# EAGLE design main2 (EAGLE 7.2.0)
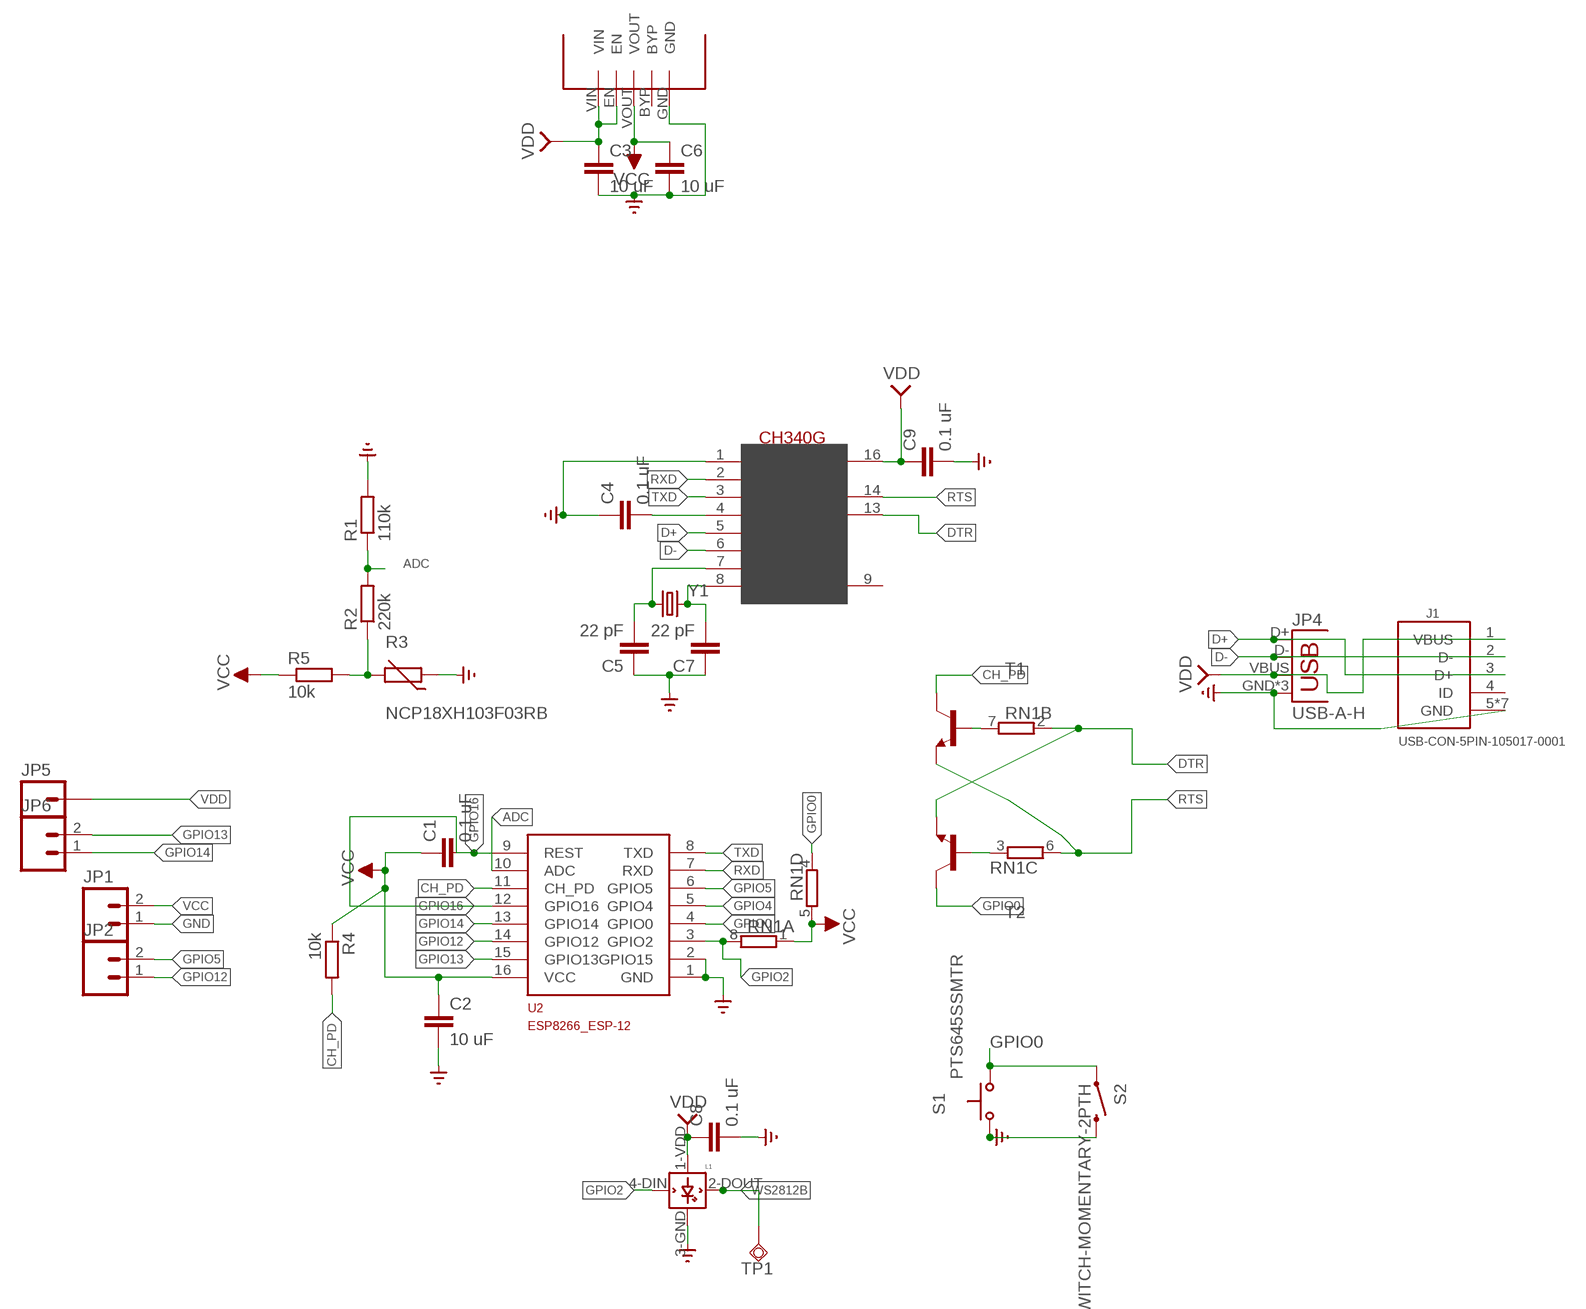
[diagram p0: schematic, sheet 1]

## Parts
C1  0.1 uF  C-EUC0603K  [C0603K]
C2  10 uF  C-EUC0603K  [C0603K]
C3  10 uF  C-EUC0603K  [C0603K]
C4  0.1 uF  C-EUC0603K  [C0603K]
C5  22 pF  C-EUC0805K  [C0805K]
C6  10 uF  C-EUC0603K  [C0603K]
C7  22 pF  C-EUC0805K  [C0805K]
C8  0.1 uF  C-EUC0603K  [C0603K]
C9  0.1 uF  C-EUC0603K  [C0603K]
J1  USB-CON-5PIN-105017-0001  [USB-MICRO-MOLEX-105017-0001]
JP1  M02LOCK  [1X02_LOCK]
JP2  M02LOCK  [1X02_LOCK]
JP4  USB-A-H  [USB-A-H]
JP5  M01PTH  [1X01]
JP6  M02LOCK  [1X02_LOCK]
L1  WS2812B  [WS2812B]
R1  110k  R-EU_R0603  [R0603]
R2  220k  R-EU_R0603  [R0603]
R3  NCP18XH103F03RB  [0603-RES]
R4  10k  R-EU_R0805  [R0805]
R5  10k  R-EU_R0805  [R0805]
RN1  4R-NEXB38V  [EXB38V]
S1  PTS645SSMTR  [PTS645-SMD]
S2  SWITCH-MOMENTARY-2PTH  [TACTILE-PTH]
T1  MMBT2222ALT1-NPN-SOT23-BEC  [SOT23-BEC]
T2  MMBT2222ALT1-NPN-SOT23-BEC  [SOT23-BEC]
TP1  TPSQTP20SQ  [TP20SQ]
U1  SPX3819  [SOT23-5L]
U2  ESP8266_ESP-12  [ESP8266-ESP12]
U3  CH340G  [SOIC16]
Y1  CRYSTALSM49  [SM49]

## Nets
ADC: R1.1 R2.2 U2.10(ADC)
CH_PD: R4.2 T1.C U2.11(CH_PD)
D+: J1.3(D+) JP4.D+ U3.5(D+)
D-: J1.2(D-) JP4.D- U3.6(D-)
DTR: RN1.2 T2.E U3.13(DTR)
GND: C2.2 C3.2 C4.1 C5.1 C6.2 C7.1 C8.2 C9.2 J1.5(GND) J1.P$1(GND) J1.P$2(GND) J1.P$3(GND) J1.P$4(GND) J1.P$5(GND) J1.P$6(GND) JP1.1 JP4.GND JP4.GND2(GND) JP4.GND3(GND) L1.3-GND(GND) R1.2 R3.1 S1.1(P) S1.2(P) S2.3 S2.4 U1.GND U2.1(GND) U2.2(GPIO15) U3.1(GND) ; supply symbol labelled GND_
GPIO0: RN1.4 S1.3(S) S1.4(S) S2.1 S2.2 T2.C U2.4(GPIO0)
GPIO2: L1.4-DIN(DIN) RN1.8 U2.3(GPIO2)
GPIO4: U2.5(GPIO4)
GPIO5: JP2.2 U2.6(GPIO5)
GPIO12: JP2.1 U2.14(GPIO12)
GPIO13: JP6.2 U2.15(GPIO13)
GPIO14: JP6.1 U2.13(GPIO14)
GPIO16: C1.2 U2.9(REST) U2.12(GPIO16)
N$1: C4.2 U3.4(V3)
N$2: RN1.3 T2.B
N$3: RN1.7 T1.B
N$4: C5.2 U3.7(XI) Y1.1
N$5: C7.2 U3.8(XO) Y1.2
N$7: R2.1 R3.2 R5.2
RTS: RN1.6 T1.E U3.14(RTS)
RXD: U2.7(RXD) U3.2(TX)
TXD: U2.8(TXD) U3.3(RX)
VCC: C1.1 C2.1 C6.1 JP1.2 R4.1 R5.1 RN1.1 RN1.5 U1.VOUT U2.16(VCC)
VDD: C3.1 C8.1 C9.1 J1.1(VBUS) JP4.VBUS JP5.1 L1.1-VDD(VDD) U1.EN U1.VIN U3.16(VCC)
WS2812B: L1.2-DOUT(DOUT) TP1.TP
Unconnected: J1.4(ID) U1.BYP U3.9(CTS)

## Library data of the parts
C1-C9 = resistor:C-EU: CAPACITOR, European symbol
J1 = VladiLib:USB-CON-5PIN: Molex Micro USB 105017-0001
JP1 JP2 JP6 = SparkFun-Connectors:M02: Standard 2-pin 0.1" header. Use with - straight break away headers ( PRT-00116) - right angle break away headers (PRT-00553) - swiss pins (PRT-00743) - machine pins (PRT-00117) - female headers (PRT-00115) Molex polarized connector foot print use with: PRT-08233 with associated crimp pins and housings. 2.54_SCREWTERM for use with PRT-10571. 3.5mm Screw Terminal footprints for PRT-08084 5mm Screw Terminal footprints for use with PRT-08432
JP4 = VladiLib:USB: USB Connectors USB-B-PTH is fully proven SKU : PRT-00139/CONN-08278 USB-miniB is fully proven SKU : PRT-00587 USB-A-PCB is untested. USB-A-H is throughly reviewed, but untested. Spark Fun Electronics SKU : PRT-00437 USB-B-SMT is throughly reviewed, but untested. Needs silkscreen touching up. USB-A-S has not been used/tested USB-MB-H has not been used/tested USB-MICROB has been used. CONN-09505; PROD_ID: CONN-08367
JP5 = SparkFun-Connectors:M01: Header 1 Standard 1-pin 0.1" header. Use with straight break away headers (SKU : PRT-00116), right angle break away headers (PRT-00553), swiss pins (PRT-00743), machine pins (PRT-00117), and female headers (PRT-00115).
L1 = VladiLib:WS2812B
R1 R2 R4 R5 = resistor:R-EU_: RESISTOR, European symbol
R3 = VladiLib:NCP18XH103F03RB: NTC 10K 1% B25/100 3455K
RN1 = resistor-dil:4R-N: Array Chip Resistor Source: RS Component / Phycomp; OC_FARNELL: unknown; OC_NEWARK: unknown
S1 = switch-ck:PTS645S???SMTR: TACT SWITCH
S2 = VladiLib:SWITCH-MOMENTARY-2: Various NO switches- pushbuttons, reed, etc; PROD_ID: SWCH-08441
T1 T2 = transistor:*-NPN-: NPN Transistror BF959 corrected 2008.03.06
TP1 = testpad:TPSQ: Test pad
U1 = VladiLib:SPX3819
U2 = VladiLib:ESP8266_ESP-12
U3 = VladiLib:CH340G
Y1 = crystal:CRYSTAL: CRYSTAL; OC_FARNELL: unknown; OC_NEWARK: unknown

## Board
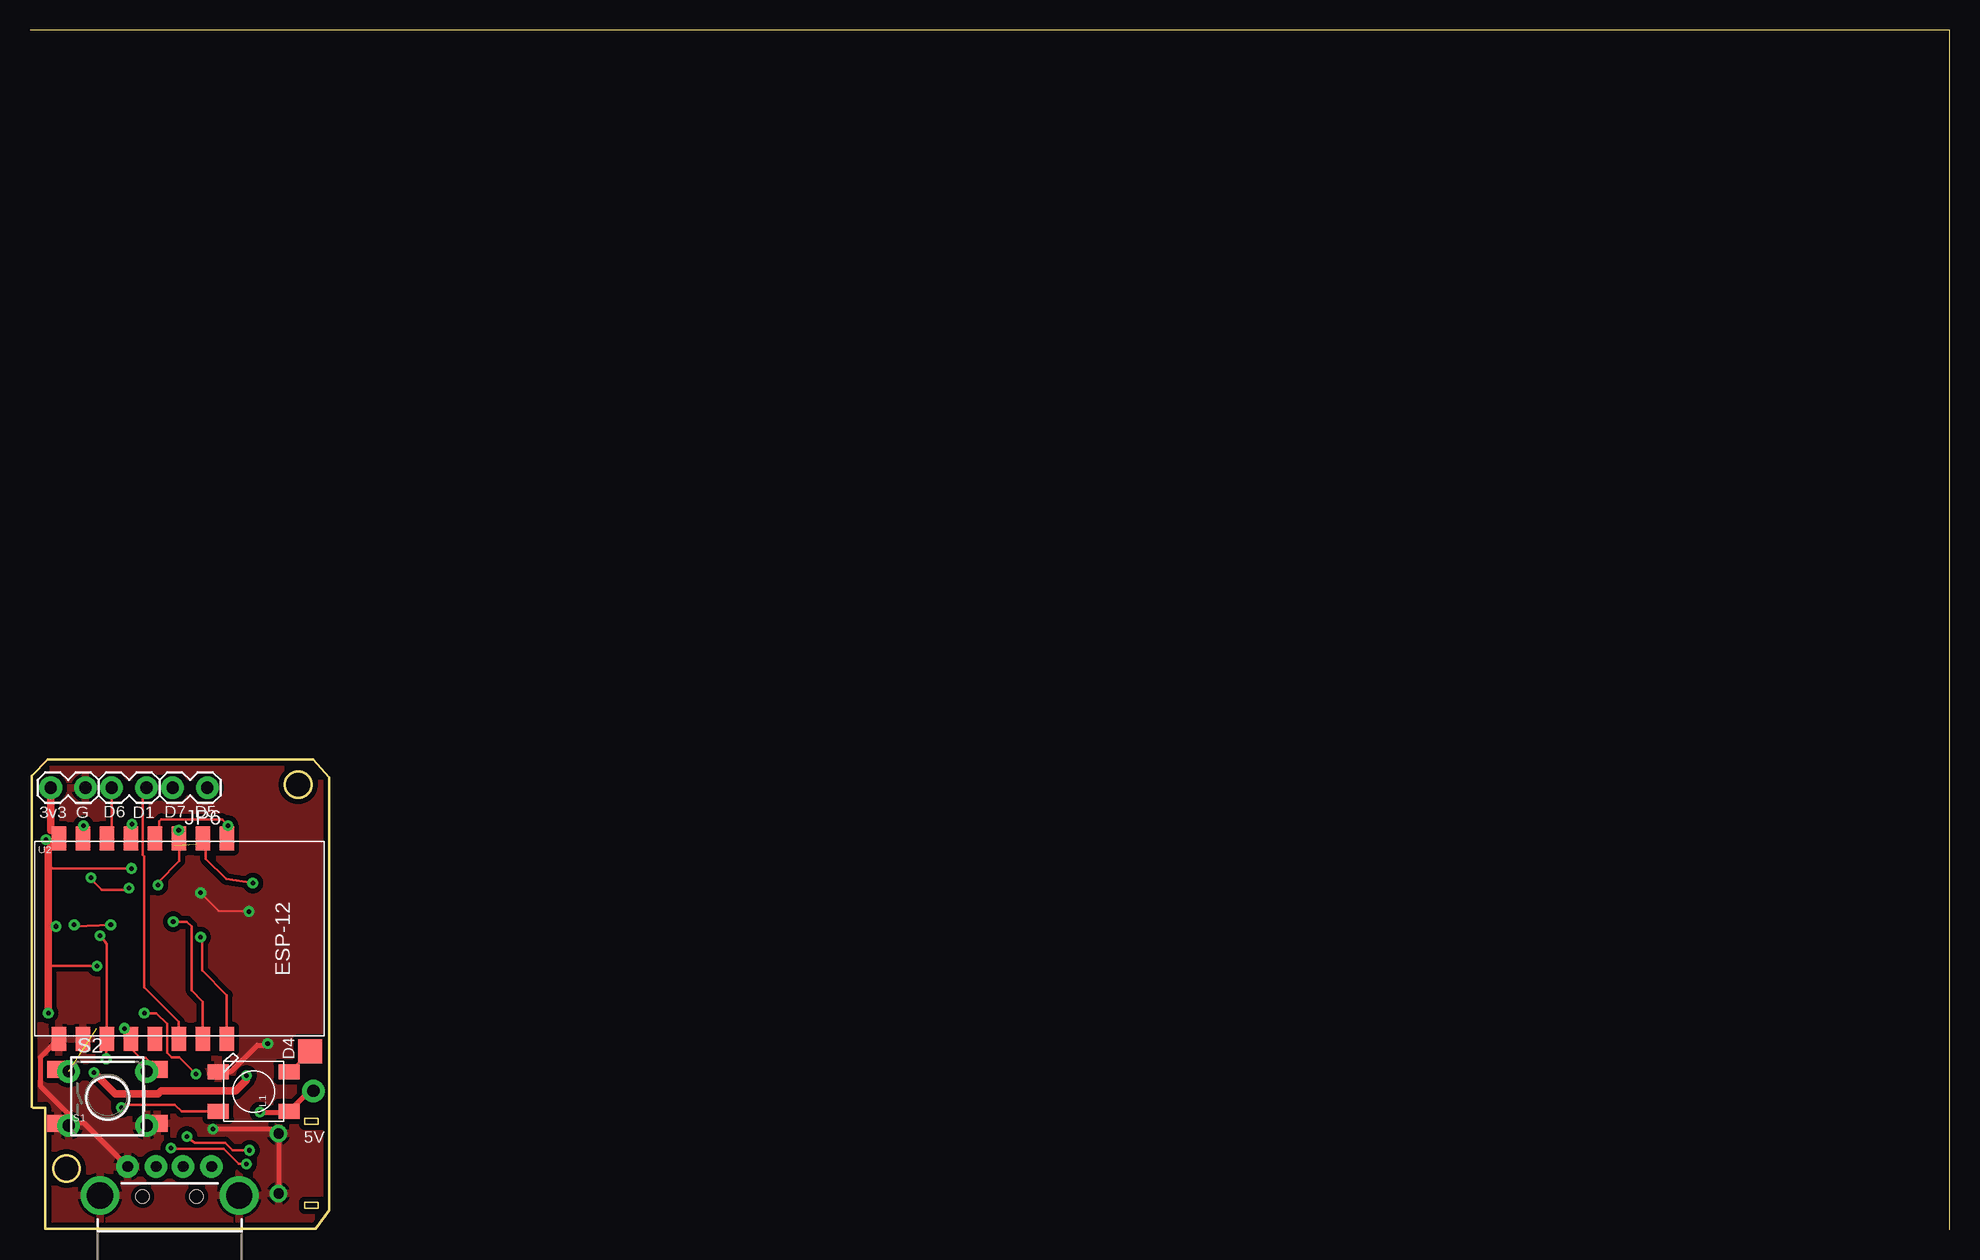
[diagram p1: board, top side]
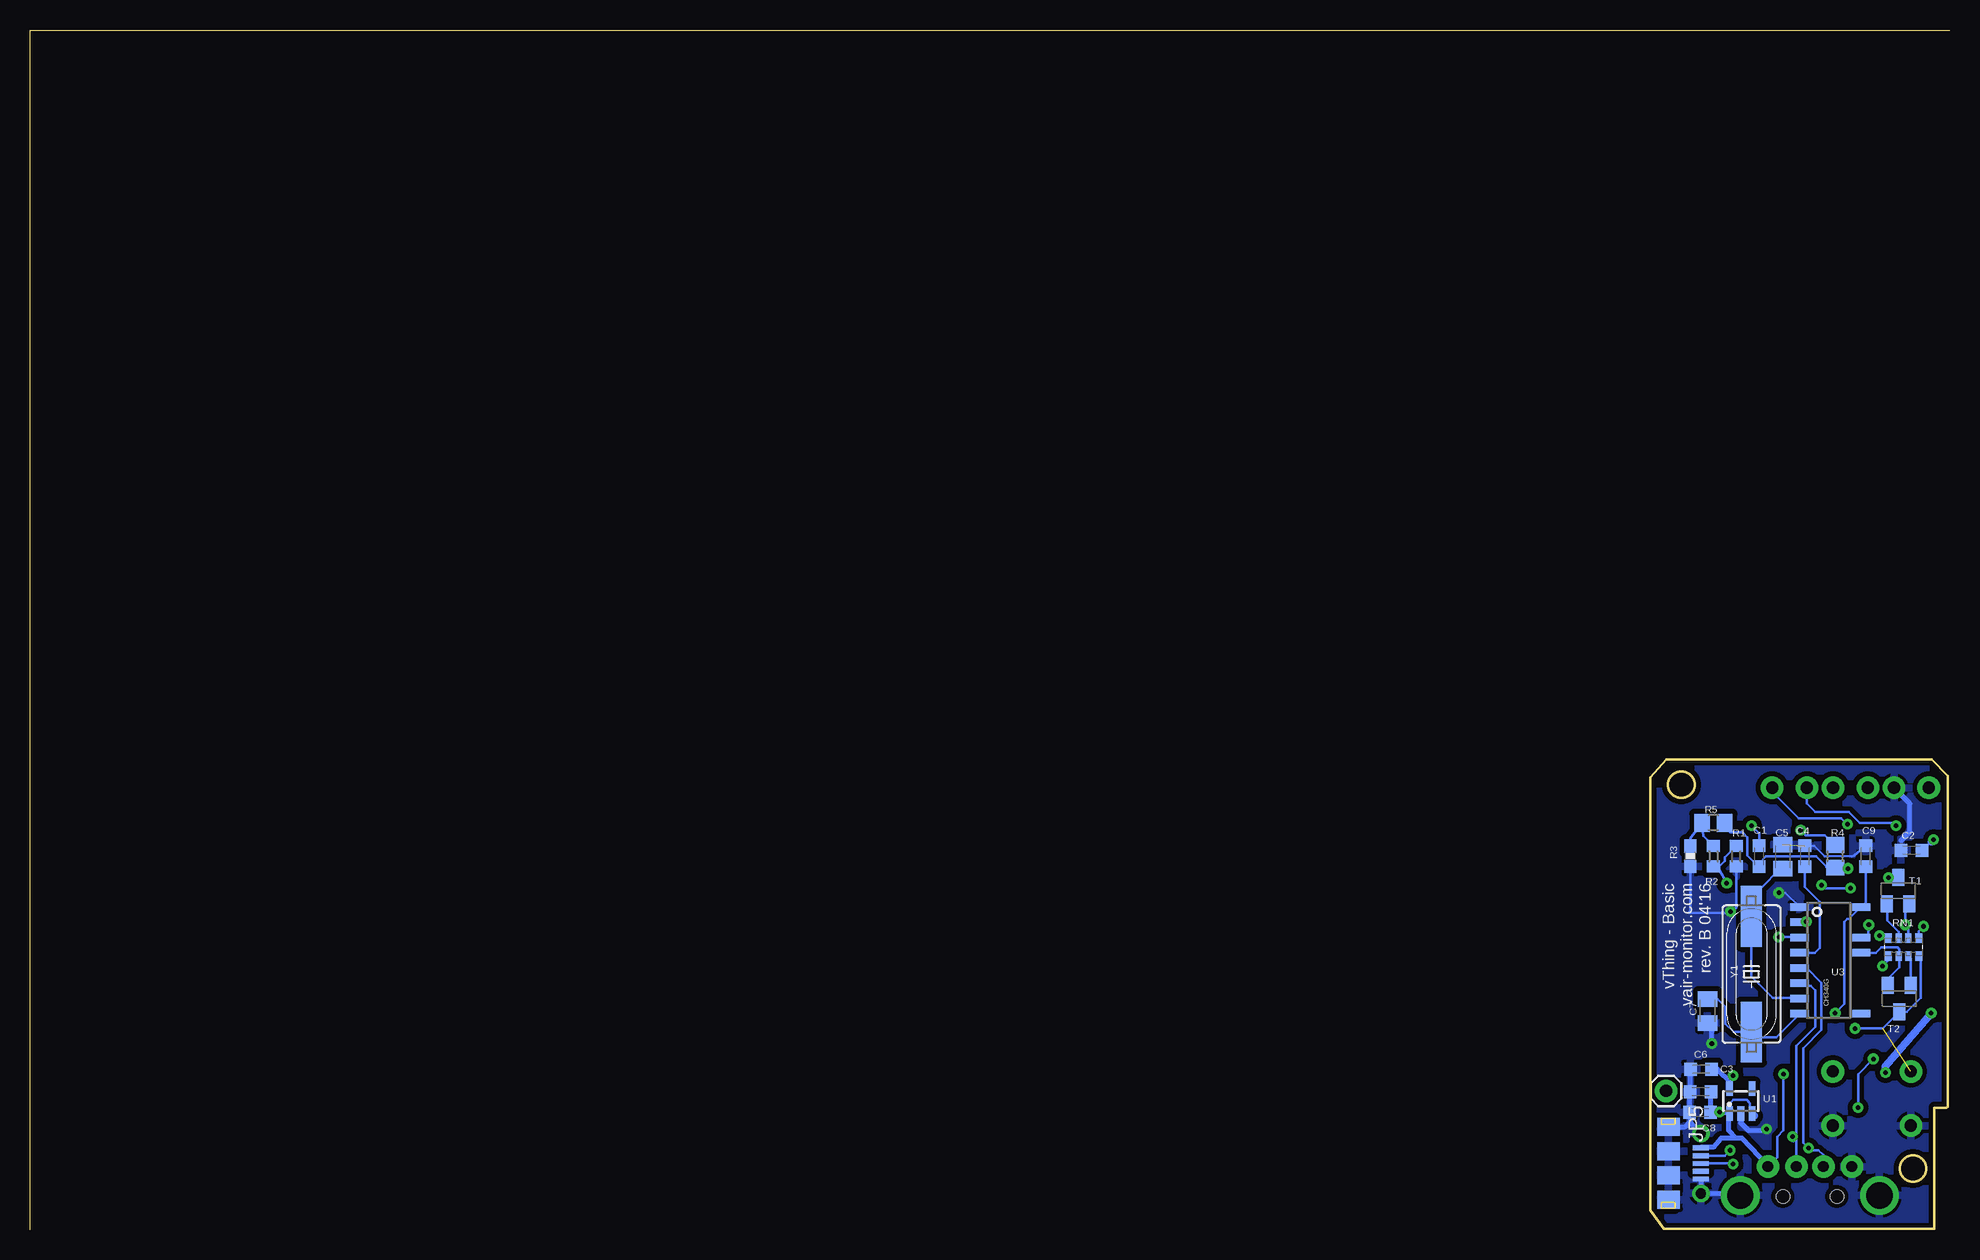
[diagram p2: board, bottom side, seen from below]

Size 160 x 100 mm. Coordinates in mm from the lower left corner, seen from the top.
Outline: 160,0 160,100 0,100
Outline: 0.15,10.24 0.15,37.8 1.47,39.19 23.62,39.19 24.92,37.67 24.92,1.6 23.8,0.08 1.27,0.08 1.27,10.16 0.25,10.16
Outline: circle at 3.05,5.08 radius 1.1
Outline: circle at 22.35,37.08 radius 1.1
Copper layers (1*16): Top 0.035mm / dielectric 1.5mm / Bottom 0.035mm
Design rules "SparkFun-2-layer *": minimum track width 7mil, minimum drill 15mil, track to track 8mil, track to pad 8mil, pad to pad 8mil, via to via 8mil, smd to smd 0mil, copper to edge 8mil, drill to drill 8mil, minimum pad ring 12mil, minimum via ring 10mil, stop-mask expansion 4mil, vias tented up to drill 20mil, thermal gap 10mil

### Footprints (pad centres in the part's own frame; a part is rotated, then mirrored left to right if it is on the bottom)
C0603K = smd 1.05 x 1.08: 1 -0.875,0; 2 0.875,0
C0805K = smd 1.3 x 1.6: 1 -1,0; 2 1,0
USB-MICRO-MOLEX-105017-0001 = smd 0.4 x 1.35: 1 1.2,0; 2 1.85,0; 3 2.5,0; 4 3.15,0; 5 3.8,0 | drill 0.85 pad 1.45: P$1 0,0; P$2 5,0 | smd 1.5 x 1.9: P$3 3.5,-2.7; P$4 1.5,-2.7; P$5 5.532,-2.7; P$6 -0.564,-2.7
1X02_LOCK = drill 1.016 pad 1.88: 1 -0.178,0; 2 2.718,0
USB-A-H = drill 0.914 pad 1.88: D+ 2.4,1.127; D- 2.4,-1.127; GND 2.4,3.5; VBUS 2.4,-3.5 | drill 2.2: GND2 0,-5.8; GND3 0,5.8 | hole 1.1: -0.1,2.25; -0.1,-2.25
1X01 = drill 1.016 pad 1.88: 1 0,0
WS2812B = smd 1.778 x 1.27: 1-VDD 2.958,-1.65; 2-DOUT 2.958,1.65; 3-GND -2.958,1.65; 4-DIN -2.958,-1.65
R0603 = smd 1 x 1.1: 1 -0.85,0; 2 0.85,0
0603-RES = smd 1.1 x 1: 1 -0.85,0; 2 0.85,0
R0805 = smd 1.3 x 1.5: 1 -0.95,0; 2 0.95,0
EXB38V = smd 0.6 x 0.8: 1 -1.275,-0.75; 4 1.275,-0.75; 5 1.275,0.75; 8 -1.275,0.75 | smd 0.5 x 0.8: 2 -0.4,-0.75; 3 0.4,-0.75; 6 0.4,0.75; 7 -0.4,0.75
PTS645-SMD = smd 1.75 x 1.4: 1 -4.15,2.25; 2 4.15,2.25; 3 -4.15,-2.25; 4 4.15,-2.25
TACTILE-PTH = drill 1.016 pad 1.88: 1 -3.251,2.261; 2 3.251,2.261; 3 -3.251,-2.261; 4 3.251,-2.261
SOT23-BEC = smd 1 x 1.4: B -0.95,-1.1; C 0,1.1; E 0.95,-1.1
TP20SQ = smd 2 x 2: TP 0,0
SOT23-5L = smd 0.55 x 1.2: BYP 0.95,1.046; EN 0.95,-1.046; GND 0,-1.046; VIN -0.95,-1.046; VOUT -0.95,1.046
ESP8266-ESP12 = smd 2 x 1.2: 1 16.454,2; 2 16.454,4; 3 16.454,6; 4 16.454,8; 5 16.454,10; 6 16.454,12; 7 16.454,14; 8 16.454,16; 9 -0.254,16; 10 -0.254,14; 11 -0.254,12; 12 -0.254,10; 13 -0.254,8; 14 -0.254,6; 15 -0.254,4; 16 -0.254,2
SOIC16 = smd 0.635 x 1.524: 1 -4.445,-2.441; 2 -3.175,-2.441; 3 -1.905,-2.441; 4 -0.635,-2.441; 5 0.635,-2.441; 6 1.905,-2.441; 7 3.175,-2.441; 8 4.445,-2.441; 9 4.445,2.695; 13 -0.635,2.695; 14 -1.905,2.695; 16 -4.445,2.695
SM49 = smd 5.08 x 1.778: 1 -4.826,0; 2 4.826,0

### Placement (x,y rotation side)
C1  15.88,31.11 90 bottom
C2  3.17,31.62 180 bottom
C3  20.73,11.49 180 bottom
C4  12.06,31.11 270 bottom
C5  13.89,31.09 270 bottom
C6  20.71,13.37 180 bottom
C7  20.17,18.22 90 bottom
C8  20.79,9.75 180 bottom
C9  6.99,31.11 90 bottom
J1  20.72,8 270 bottom
JP1  4.45,36.83 180 top
JP2  6.99,36.83 0 top
JP4  11.64,2.85 90 top
JP5  23.62,11.56 270 bottom
JP6  14.61,36.83 180 top
L1  18.65,11.5 0 top
R1  17.78,31.11 270 bottom
R2  19.68,31.11 270 bottom
R3  21.59,31.11 90 bottom
R4  9.53,31.11 90 bottom
R5  19.68,33.91 180 bottom
RN1  3.84,23.55 0 bottom
S1  PTS645S??SMTR  [PTS645-SMD]  6.45,11.1 180 top
S2  6.48,10.92 0 top
T1  4.28,28.25 0 bottom
T2  4.19,19.25 180 bottom
TP1  23.34,14.86 90 top
U1  17.4,10.7 0 bottom
U2  0.41,32.33 270 top
U3  10.05,22.44 270 bottom
Y1  16.52,21.29 270 bottom

### Tracks (layer width: path | path; a pad name or v marks a point on that pad's centre or on a via)
ADC  (via drill 0.38)
  Top 0.203: U2.10 14.66,32.34 14.66,30.91 16.36,29.21 v18.57,28.88
  Bottom 0.203: R2.2 19.19,30.27 | 19.19,30.27 18.72,30.73 18.72,31.02 R1.1 | v18.57,28.88 19.19,29.98 19.19,30.27
CH_PD  (via drill 0.38)
  Top 0.203: v12.39,33.3 12.41,33.16 U2.11 12.45,32.55 12.45,30.73 10.67,28.96 v10.67,28.7 | v5.08,29.34 5.08,29.21 5.97,28.32 8.13,28.32 v8.26,28.45
  Bottom 0.203: R4.2 10.4,32.84 11.96,32.84 12.01,32.89 v12.39,33.3 | T1.C v5.07,29.35 v5.08,29.34 | v8.26,28.45 10.41,28.45 v10.67,28.7
D+  (via drill 0.38)
  Top 0.203: v18.03,5.46 17.4,5.46 16.13,6.73 11.81,6.73 v11.75,6.79
  Bottom 0.203: U3.5 11.9,21.8 10.67,20.57 10.67,16.64 12.19,15.11 12.19,7.24 v11.75,6.79 | v11.75,6.79 11.56,6.6 11.43,6.6 | 11.43,6.6 10.92,6.6 10.54,6.22 10.54,5.28 JP4.D+ | J1.3 18.07,5.5 v18.03,5.46 | v11.75,6.79 11.62,6.79 11.43,6.6
D-  (via drill 0.38)
  Top 0.203: v18.29,6.6 16.89,6.6 16.26,7.24 13.72,7.24 v13.08,7.75
  Bottom 0.203: JP4.D- 12.76,7.62 | 12.76,7.62 12.76,15.3 11.18,16.89 11.18,19.94 11.56,20.32 12.27,20.32 U3.6 | J1.2 18.74,6.15 v18.29,6.6 | v13.08,7.75 13.02,7.37 12.76,7.62
DTR
  Bottom 0.203: T2.E 5.14,20.89 4.19,21.84 4.19,22.75 RN1.2 4.19,22.84 4.19,23.37 4.29,23.52 5.69,23.52 6.14,23.07 U3.13
GND  (via drill 0.38)  (1 unrouted)
  Top 0.203: v14.22,28.07 15.75,26.54 v18.24,26.52 | 10.16,8.89 S1.1 9.92,8.85 S2.4
  Top 0.406: J1.P$2 J1.P$1 20.34,8.38 v15.24,8.38 | L1.3-GND 16.71,13.15 18.92,15.37 19.68,15.37 v19.81,15.49 | S2.3 2.49,8.66 S1.2 3.98,8.85 | JP4.GND 4.54,8.85 3.98,8.85 | 3.98,8.85 0.89,11.94 0.89,14.36 U2.1
  Bottom 0.178: 8.13,31.11 10.41,31.11
  Bottom 0.203: C9.2 7.94,31.19 8.03,31.14 8.13,31.11 | 10.41,31.11 11.29,31.99 C4.1 | U3.1 13.67,28.07 v14.22,28.07 | R3.1 21.59,26.54 21.72,26.42 18.16,26.42 v18.24,26.52 17.78,26.8 R1.2
  Bottom 0.406: JP4.GND2 17.59,3 J1.P$2 J1.5 | C6.2 21.61,13.34 C3.2 21.66,11.44 C8.2 21.66,8.94 | 21.66,8.94 J1.P$1 | U1.GND 17.4,8.89 16.76,8.26 15.37,8.26 v15.24,8.38 | 4.05,32.4 3.3,33.15 3.3,35.51 JP1.1 | v19.81,15.49 19.81,16.51 C7.1 | J1.P$6 22.03,8.56 21.66,8.94
  pour Bottom (isolate 0.406): -2.54,-2.54 29.21,-2.54 29.21,41.91 -2.54,41.91
  pour Top (isolate 0.406): -1.47,-1.32 27.94,-1.27 27.94,40.64 -1.27,40.64 -1.27,-1.27
GPIO0  (via drill 0.38)  (1 unrouted)
  Top 0.203: S1.3 9.65,14.3 9.2,14.3 8.41,15.09 U2.4 8.41,16.23 v7.87,16.76
  Top 0.406: S1.3 9.89,13.35 S2.2
  Top 0.61: S2.1 2.47,13.18 S1.4
  Bottom 0.203: v7.87,16.76 5.58,16.76 T2.C 3.57,18.15 2.41,19.3 2.41,22.8 RN1.4
GPIO2  (via drill 0.38)
  Top 0.203: L1.4-DIN 12.63,9.85 12.06,10.41 7.87,10.41 v7.62,10.16 | v6.35,14.22 6.35,15.82 U2.3 6.41,23.82 v5.84,24.51
  Bottom 0.203: v7.62,10.16 7.62,12.95 v6.35,14.22 | v5.84,24.51 5.15,24.26 RN1.8
GPIO5
  Top 0.203: U2.6 12.41,17.31 9.53,20.19 9.53,31.11 9.4,31.24 9.4,36.52 JP2.2
GPIO12
  Top 0.203: JP2.1 6.81,32.99 U2.14
GPIO13  (via drill 0.38)
  Top 0.203: v4.45,33.66 4.45,32.63 U2.15
  Bottom 0.203: JP6.2 11.89,35.51 11.18,34.8 8.38,34.8 7.49,33.91 4.7,33.91 v4.45,33.66
GPIO14  (via drill 0.38)
  Top 0.203: v8.51,33.78 8.51,32.69 U2.13
  Bottom 0.203: JP6.1 14.78,36.5 12.57,34.29 9.02,34.29 v8.51,33.78
GPIO16  (via drill 0.38)
  Top 0.203: U2.12 10.77,32.95 10.77,34.01 10.95,34.19 16,34.19 16.41,33.78 U2.9 16.51,32.69 v16.51,33.66
  Bottom 0.203: v16.51,33.66 15.88,33.02 C1.2
N$1
  Bottom 0.203: U3.4 11.22,23.07 10.79,23.5 10.79,27.3 12.06,28.57 C4.2
N$2
  Bottom 0.203: T2.B 3.25,22.61 RN1.3
N$3
  Bottom 0.203: RN1.7 4.24,24.81 5.21,25.78 5.21,27.12 T1.B
N$4
  Bottom 0.203: U3.7 12.53,19.3 14.73,19.3 16.52,21.09 Y1.1 15.88,26.75 15.88,28.32 13.97,30.23 C5.2
N$5
  Bottom 0.203: U3.8 14.46,16.02 16.08,16.02 Y1.2 17.96,16.46 18.67,17.16 18.67,18.54 19.35,19.22 C7.2
N$7
  Bottom 0.203: R3.2 21.59,32.6 R5.2 20.54,32.81 R2.1
RTS  (via drill 0.38)
  Top 0.203: v6.73,25.4 3.81,25.27 v3.68,25.4
  Bottom 0.203: U3.14 6.77,24.34 v6.73,25.4 | T1.E 3.68,26.8 v3.68,25.4 3.44,25.15 RN1.6
RXD  (via drill 0.38)
  Top 0.203: U2.7 14.41,19 13.46,19.94 13.46,25.27 13.08,25.65 v11.94,25.65
  Bottom 0.203: v11.94,25.65 12.45,25.65 U3.2
TXD  (via drill 0.38)
  Top 0.203: U2.8 16.41,19.54 14.35,21.59 14.35,24.26 v14.22,24.38
  Bottom 0.203: v14.22,24.38 12.53,24.38 U3.3
VCC  (via drill 0.38)
  Top 0.203: 1.73,33.27 U2.16 2.33,32.51 v1.32,32.51 | v2.16,25.27 1.52,25.27 | v5.59,21.97 1.78,21.97 1.52,22.23 | v8.46,30.1 1.91,30.1 1.52,30.48
  Top 0.61: JP1.2 1.73,33.27 | v18.03,12.83 18.03,12.45 17.14,11.56 10.92,11.56 10.67,11.3 7.11,11.3 v5.33,13.08 | v1.52,18.03 1.52,22.23 1.52,25.27 1.52,30.48 1.52,31.71 U2.16
  Bottom 0.203: C2.1 1.84,31.99 v1.32,32.51 | R5.1 18.28,33.1 17.25,33.1 16.84,32.69 16.84,31.2 C1.1 15.88,30.53 15.32,31.09 11.11,31.09 10.29,30.27 10.29,30.23 10.25,30.27 R4.1 8.93,30.27 v8.46,30.1 | RN1.5 2.56,24.87 v2.16,25.27 | RN1.1 5.11,22.45 v5.59,21.97
  Bottom 0.406: C6.1 19.34,13.37 18.29,12.32 18.29,11.81 U1.VOUT
  Bottom 0.61: U1.VOUT 18.35,12.51 v18.03,12.83 | v5.33,13.08 5.33,13.59 v1.52,18.03 | 1.52,32.31 v1.32,32.51
VDD  (via drill 0.38)
  Top 0.203: v9.53,18.03 10.54,18.03 11.43,17.14 11.43,14.73 11.81,14.35 12.45,14.35 v13.84,12.95
  Top 0.406: v19.18,9.78 21.53,9.78 L1.1-VDD 23.31,11.56 JP5.1
  Bottom 0.203: C9.1 6.99,27.25 U3.16 7.41,26.88 8.38,25.91 8.51,25.91 8.76,25.65 8.76,18.8 v9.53,18.03 | U1.VIN 18.35,10.48 18.03,10.79 16.89,10.79 16.64,10.54 16.64,9.85 U1.EN | v13.84,12.95 13.84,8.26 14.35,7.75 14.35,6.04 JP4.VBUS
  Bottom 0.406: JP4.VBUS 15.14,5.36 17.27,7.62 17.78,7.62 | 17.78,7.62 19.05,7.62 19.68,6.86 20.67,6.86 J1.1 | 17.78,7.62 18.41,8.26 18.41,9.59 U1.VIN 18.44,9.75 C8.1 | C8.1 19.2,9.75 v19.18,9.78 | C8.1 19.91,11.44 C3.1
  Bottom 0.61: 16.26,9.46 U1.EN
WS2812B
  Top 0.203: TP1.TP L1.2-DOUT

### Text on the board
tPlace: 3v3 | D1 | G | D6 | D7 | D5 | D4 | 5V
bPlace: vThing - Basic / vair-monitor.com / rev. B 04'16
bNames: U3